# Altium schematic sheet GNSS modulis.SchDoc
size B; SheetNumber: 1; SheetTotal: 6
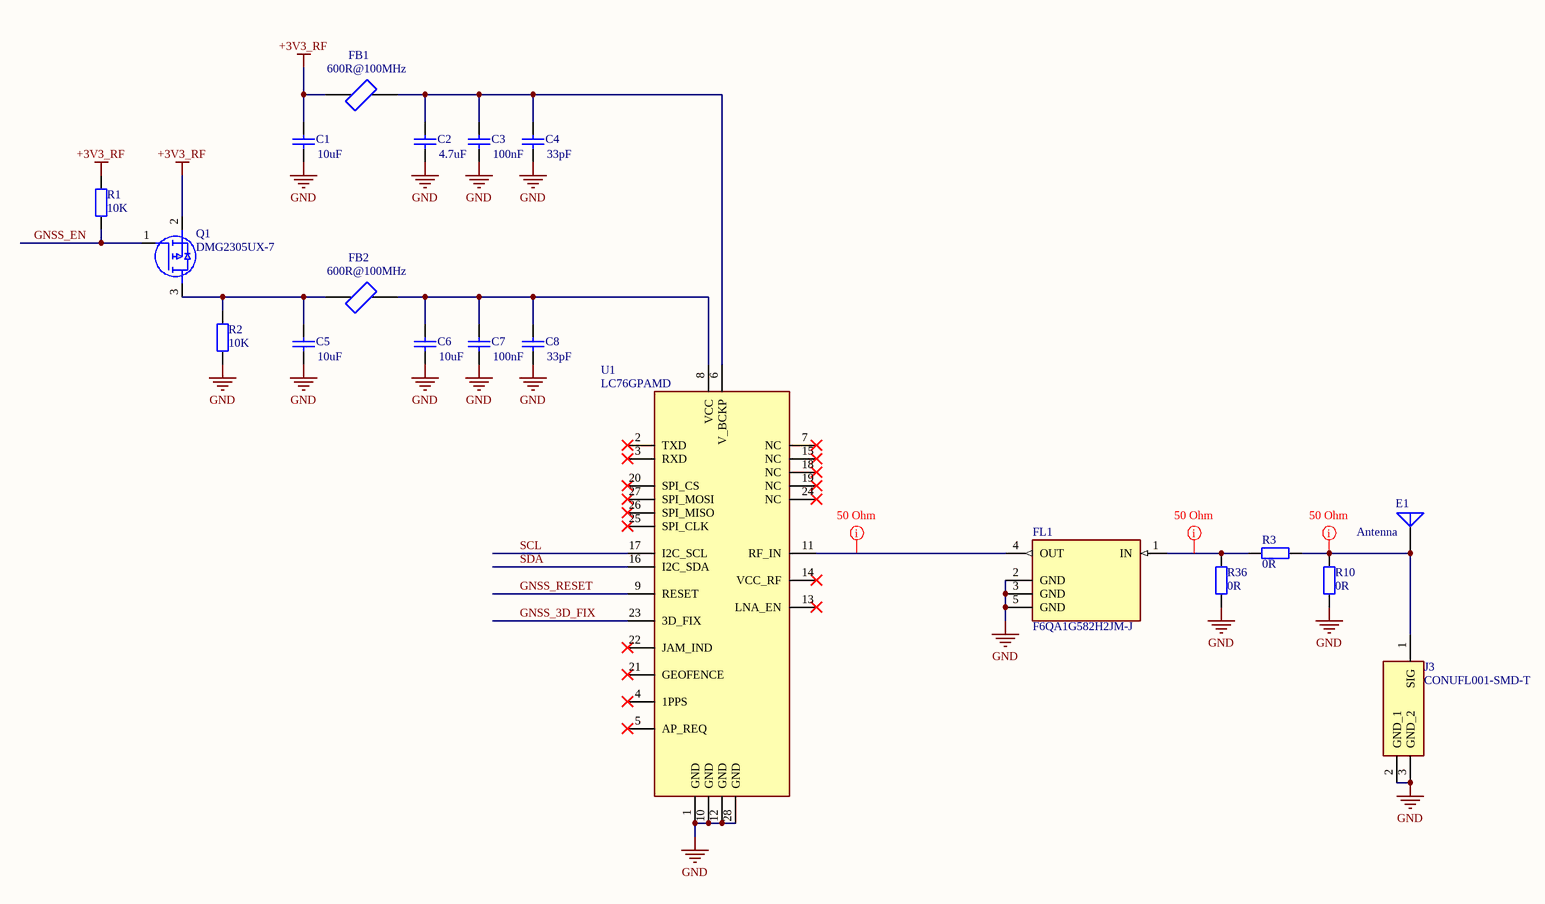
[diagram p0: GNSS modulis.SchDoc]

## Parts
C1  10uF  [SMD-0805C]
C2  4.7uF  [SMD-0603C]
C3  100nF  [SMD-0402C]
C4  33pF  [SMD-0402C]
C5  10uF  [SMD-0805C]
C6  10uF  [SMD-0805C]
C7  100nF  [SMD-0402C]
C8  33pF  [SMD-0402C]
E1  Antenna  [204286-0001_MOL]
FB1  600R@100MHz  [0402 Ferrite Bead]
FB2  600R@100MHz  [0402 Ferrite Bead]
FL1  F6QA1G582H2JM-J  [FIL_F6QA1G582H2JM-J]
J3  CONUFL001-SMD-T  [CONUFL001SMDT]
Q1  DMG2305UX-7  [DMG2305UX-7]
R1  10K  [SMD-0402-RES]
R2  10K  [SMD-0402-RES]
R3  0R  [SMD-0402-RES]
R10  0R  [SMD-0402-RES]
R36  0R  [SMD-0402-RES]
U1  LC76GPAMD  [LC76GPAMD]

## Nets
+3V3_RF: C1.2 FB1.1 Q1.2(S) R1.2
GND: C1.1 C2.1 C3.1 C4.1 C5.1 C6.1 C7.1 C8.1 FL1.2(GND) FL1.3(GND) FL1.5(GND) J3.2(GND_1) J3.3(GND_2) R2.1 R10.1 R36.1 U1.1(GND) U1.10(GND) U1.12(GND) U1.28(GND)
GNSS_3D_FIX: U1.23(3D_FIX)
GNSS_EN: Q1.1(G) R1.1
GNSS_RESET: U1.9(RESET)
SCL: U1.17(I2C_SCL)
SDA: U1.16(I2C_SDA)
NetC2_2: C2.2 C3.2 C4.2 FB1.2 U1.6(V_BCKP)
NetC5_2: C5.2 FB2.1 Q1.3(D) R2.2
NetC6_2: C6.2 C7.2 C8.2 FB2.2 U1.8(VCC)
NetE1_1: E1.1(A) J3.1(SIG) R3.1 R10.2
NetFL1_1: FL1.1(IN) R3.2 R36.2
NetFL1_4: FL1.4(OUT) U1.11(RF_IN)

Not connected (* = marked no-connect by the designer): U1 2(TXD)* 3(RXD)* 4(1PPS)* 5(AP_REQ)* 7(NC)* 13(LNA_EN)* 14(VCC_RF)* 15(NC)* 18(NC)* 19(NC)* 20(SPI_CS)* 21(GEOFENCE)* 22(JAM_IND)* 24(NC)* 25(SPI_CLK)* 26(SPI_MISO)* 27(SPI_MOSI)*

## Layout directives
net class 50 Ohm BLE GNSS: NetE1_1, NetFL1_1, NetFL1_4

## Library data of the parts
C1-C8 = Cap: Capacitor; Published: 8-Jun-2000; LatestRevisionDate: 17-Jul-2002; LatestRevisionNote: Re-released for DXP Platform.; PackageReference: RAD-0.3; Publisher: Altium Limited; PackageDescription: Radial Cap, Thru-Hole; 2 Leads; 0.3 in Pin Spacing; Supplier 1: Mouser
  C1 C5 C6: Value: 10uF; Supplier Part Number 1: 187-CL21A106KOQNNNG
  C2: Value: 4.7uF; Supplier Part Number 1: 187-CL10A475KO8NNNC
  C3 C7: Value: 100nF; Supplier Part Number 1: 603-CC402KRX7R7BB104
  C4 C8: Value: 33pF; Supplier Part Number 1: 81-GCM1555C1H330JA6D
E1 = Antenna: Generic Antenna; Published: 24-Mar-1999; LatestRevisionDate: 17-Jul-2002; LatestRevisionNote: Re-released for DXP Platform.; PackageReference: PIN1; Publisher: Altium Limited; Supplier 1: Mouser; Supplier Part Number 1: 538-204286-0001
FB1 FB2 = Ferrite: Ferrite Beads FERRITE BEAD 600 OHM 0402 1LN; MF: Laird-Signal Integrity Products; MP: MI0805K400R-10; SnapEDA_Link: https://www.snapeda.com/parts/MI0805K400R-10/Laird-Signal+Integrity+Products/view-part/?ref=snap; Package: 0805 Laird; Value: *; Check_prices: https://www.snapeda.com/parts/MI0805K400R-10/Laird-Signal+Integrity+Products/view-part/?ref=eda; Supplier 1: Mouser; Supplier Part Number 1: 81-BLM15AX601SN1D
FL1 = F6QA1G582H2JM-J: 1.582GHz Frequency GPS RF SAW Filter (Surface Acoustic Wave) 1.8dB  Bandwidth 5-SMD, No Lead; MF: Taiyo Yuden; SnapEDA_Link: https://www.snapeda.com/parts/F6QA1G582H2JM-J/Taiyo+Yuden/view-part/?ref=snap; Package: SMD-5 Taiyo Yuden; Value: *; MP: F6QA1G582H2JM-J; Check_prices: https://www.snapeda.com/parts/F6QA1G582H2JM-J/Taiyo+Yuden/view-part/?ref=eda; Supplier 1: Mouser; Supplier Part Number 1: 963-F6QA1G582H2JM-J
J3 = CONUFL001-SMD-T: Connector; Manufacturer_Name: TE Connectivity; Datasheet Link: https://eu.mouser.com/datasheet/2/418/9/ENG_DS_CONUFL001_SMD_T_B-3238717.pdf; Height: 1.3mm; Manufacturer_Part_Number: CONUFL001-SMD-T; Mouser Part Number: N/A; Mouser Price/Stock: https://www.mouser.co.uk/ProductDetail/TE-Connectivity/CONUFL001-SMD-T?qs=3Rah4i%252BhyCHmRzMH%252BkLkPQ%3D%3D; Arrow Part Number: CONUFL001-SMD-T; Arrow Price/Stock: https://www.arrow.com/en/products/conufl001-smd-t/te-connectivity?utm_currency=USD&region=europe; Supplier 1: Mouser; Supplier Part Number 1: 712-CONUFL001-SMD-T
Q1 = DMG2305UX-7: MOSFET P-Ch 20V 5A Enhancement SOT23 Diodes Inc DMG2305UX-7 P-channel MOSFET Transistor, -3.3 A, -20 V, 3-Pin SOT-23; Manufacturer_Name: Diodes Incorporated; Geometry.Height: 1.15mm; Mouser Part Number: 621-DMG2305UX-7; Mouser Price/Stock: https://www.mouser.co.uk/ProductDetail/Diodes-Incorporated/DMG2305UX-7?qs=L1DZKBg7t5F%2FNBHrjfxC%252Bg%3D%3D; Manufacturer_Part_Number: DMG2305UX-7; Datasheet Link: https://www.diodes.com//assets/Datasheets/DMG2305UX.pdf; Supplier 1: Mouser; Supplier Part Number 1: 621-DMG2305UX-7
R1-R3 R10 R36 = Res2: Resistor; Published: 8-Jun-2000; LatestRevisionDate: 17-Jul-2002; LatestRevisionNote: Re-released for DXP Platform.; PackageReference: AXIAL-0.4; Publisher: Altium Limited; PackageDescription: Axial Device, Thru-Hole; 2 Leads; 0.4 in Pin Spacing; Supplier 1: Mouser
  R1 R2: Value: 10K; Supplier Part Number 1: 603-RC0402FR-7D10KL
  R3 R10 R36: Value: 0R; Supplier Part Number 1: 603-RC0402FR-070RL
U1 = LC76GPAMD: Manufacturer_Name: Quectel; Datasheet Link: https://www.mouser.es/pdfDocs/L76_and_LC76_series_Hardware_Comparison_V1020220515.pdf; Height: 2.7mm; Manufacturer_Part_Number: LC76GPAMD; Mouser Part Number: 277-LC76GPAMD; Mouser Price/Stock: https://www.mouser.co.uk/ProductDetail/Quectel/LC76GPAMD?qs=vvQtp7zwQdMfDuCTmjRUww%3D%3D; Arrow Part Number: LC76GPAMD; Arrow Price/Stock: https://www.arrow.com/en/products/lc76gpamd/quectel-wireless-solutions-co-ltd?utm_currency=USD&region=nac; Supplier 1: Mouser; Supplier Part Number 1: 277-LC76GPAMD